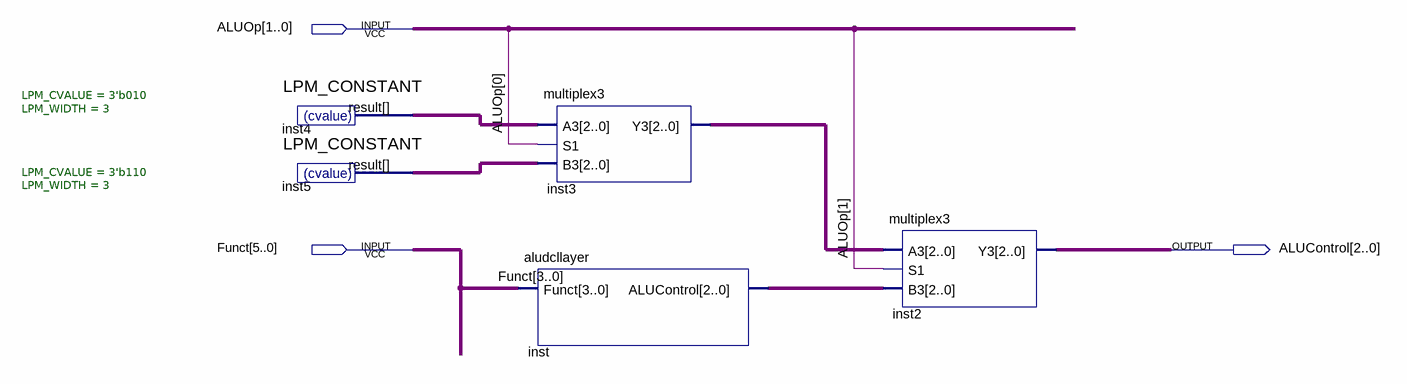
[diagram p0: schematic sheet]
// Quartus schematic aluDecoder.bdf as structural Verilog: 5 symbols, 3 pins
module aluDecoder (
  input  [1:0] ALUOp,
  input  [5:0] Funct,
  output [2:0] ALUControl
);

  wire [2:0] inst3_y3, inst4_result, inst5_result, inst_alucontrol;

  LPM_CONSTANT #(.LPM_CVALUE(3'b010), .LPM_WIDTH(3)) inst4 (.result(inst4_result));
  LPM_CONSTANT #(.LPM_CVALUE(3'b110), .LPM_WIDTH(3)) inst5 (.result(inst5_result));
  multiplex3 inst3 (.A3(inst4_result), .S1(ALUOp[0]), .B3(inst5_result), .Y3(inst3_y3));
  aludcllayer inst (.Funct(Funct[3:0]), .ALUControl(inst_alucontrol));
  multiplex3 inst2 (.A3(inst3_y3), .S1(ALUOp[1]), .B3(inst_alucontrol), .Y3(ALUControl));
endmodule
